# EAGLE design RobotController (EAGLE 9.3.1)
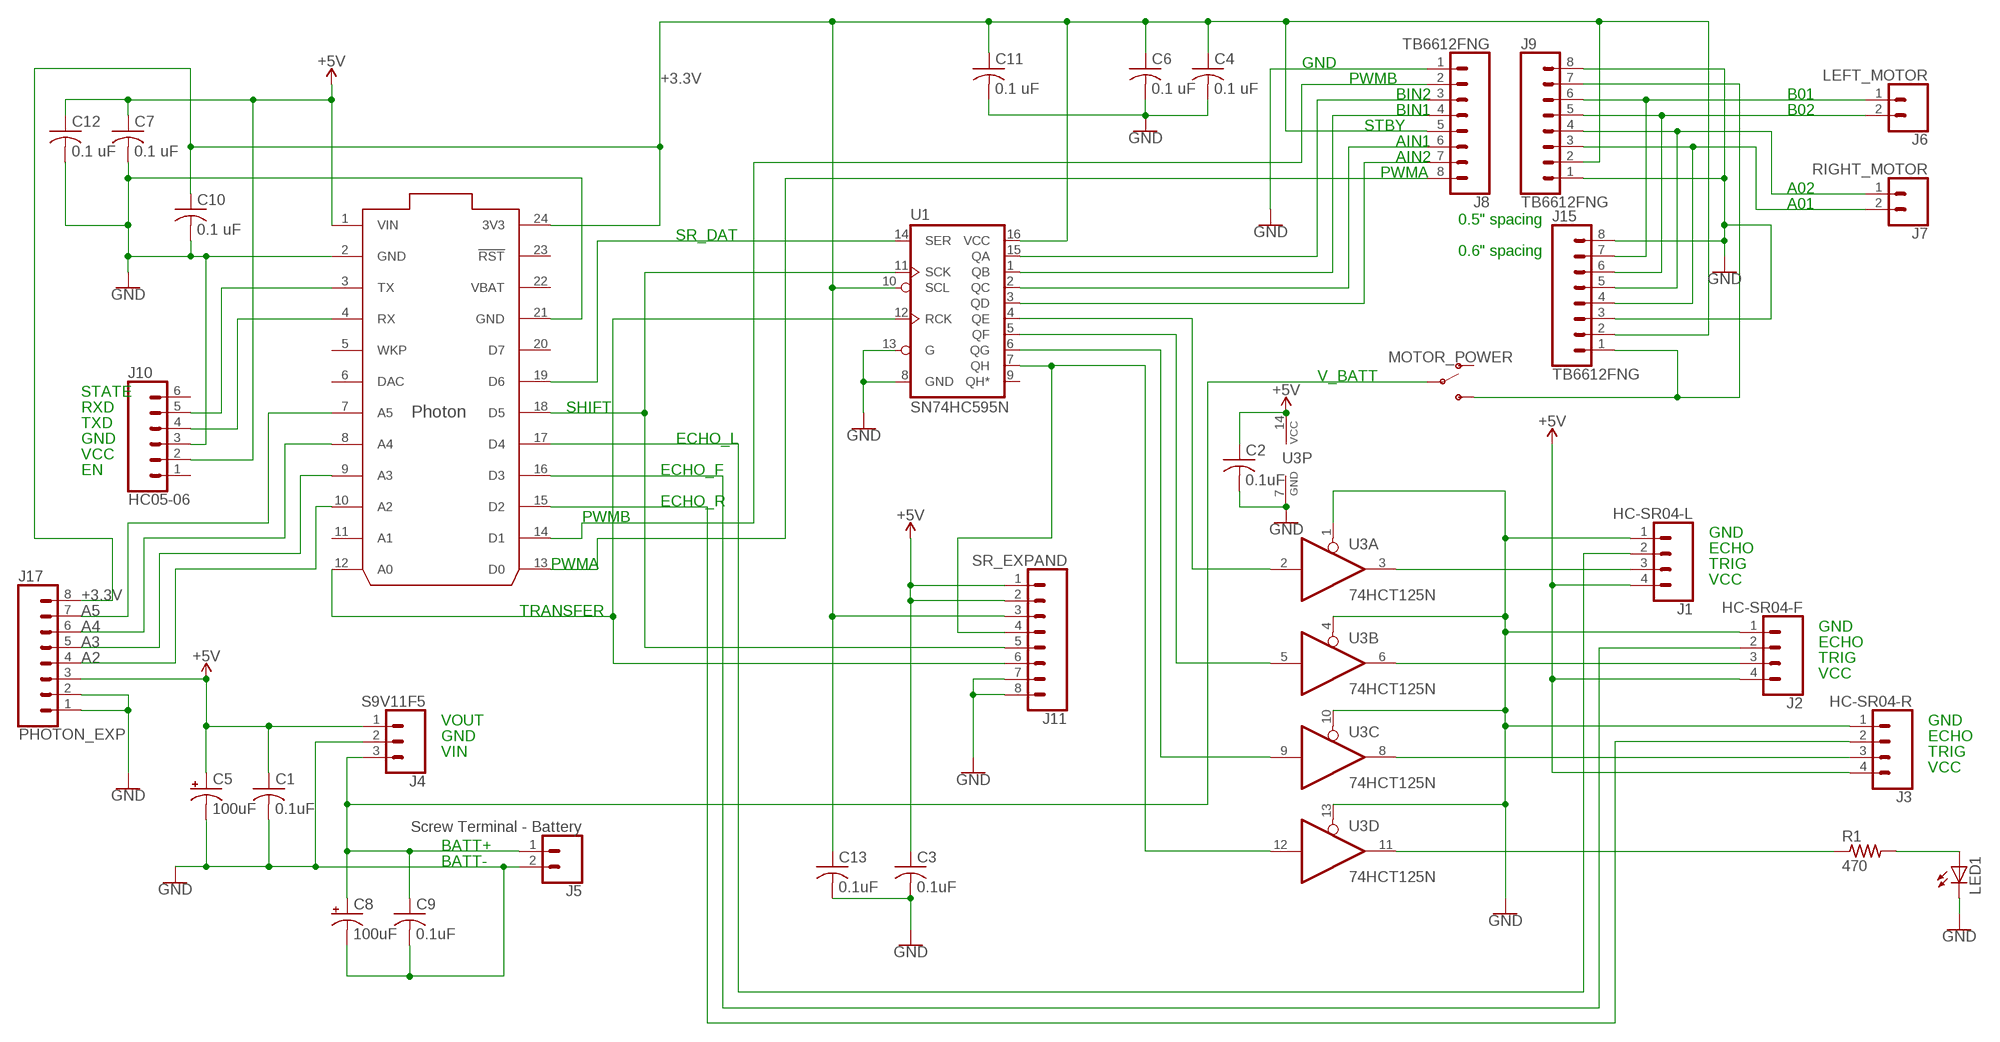
[diagram p0: schematic, sheet 1]

## Parts
C1  0.1uF  C-US025-024X044  [C025-024X044]
C2  0.1uF  C-US025-024X044  [C025-024X044]
C3  0.1uF  C-US025-024X044  [C025-024X044]
C4  0.1 uF  C-US025-024X044  [C025-024X044]
C5  100uF  CPOL-USE2,5-6E  [E2,5-6E]
C6  0.1 uF  C-US025-024X044  [C025-024X044]
C7  0.1 uF  C-US025-024X044  [C025-024X044]
C8  100uF  CPOL-USE2,5-6E  [E2,5-6E]
C9  0.1uF  C-US025-024X044  [C025-024X044]
C10  0.1 uF  C-US025-024X044  [C025-024X044]
C11  0.1 uF  C-US025-024X044  [C025-024X044]
C12  0.1 uF  C-US025-024X044  [C025-024X044]
C13  0.1uF  C-US025-024X044  [C025-024X044]
J1  HC-SR04-L  CONN_04  [1X04]
J2  HC-SR04-F  CONN_04  [1X04]
J3  HC-SR04-R  CONN_04  [1X04]
J4  S9V11F5  CONN_03  [1X03]
J5  Screw Terminal - Battery  CONN_023.5MM  [SCREWTERMINAL-3.5MM-2]
J6  LEFT_MOTOR  CONN_023.5MM  [SCREWTERMINAL-3.5MM-2]
J7  RIGHT_MOTOR  CONN_023.5MM  [SCREWTERMINAL-3.5MM-2]
J8  TB6612FNG  CONN_08"  [1X08]
J9  TB6612FNG  CONN_08"  [1X08]
J10  HC05-06  CONN_06SILK_FEMALE_PTH  [1X06]
J11  SR_EXPAND  CONN_08"  [1X08]
J15  TB6612FNG  CONN_08"  [1X08]
J17  PHOTON_EXP  CONN_08"  [1X08]
LED1  LED5MM  [LED5MM]
MOTOR_POWER  SWITCH-SPDT-PTH-11.6X4.0MM  [SWITCH_SPDT_PTH_11.6X4.0MM]
R1  470  R-US_0207/10  [0207/10]
U1  SN74HC595N  74HC595N  [DIP16]
U3  74HCT125N  [DIL14]
U$1  PHOTON_WITH_HEADERS  [PHOTON]

## Nets
+3.3V: C4.1 C6.1 C10.1 C11.1 C13.1 J8.5 J9.2 J11.3 J15.2 J17.8 U1.10(SCL) U1.16(VCC) U$1.24(3V3)
A2: J17.4 U$1.10(A2)
A3: J17.5 U$1.9(A3)
A4: J17.6 U$1.8(A4)
A5: J17.7 U$1.7(A5)
GND: C1.2 C2.2 C3.2 C4.2 C5.- C6.2 C7.2 C8.- C9.2 C10.2 C11.2 C12.2 C13.2 J1.1 J2.1 J3.1 J4.2 J5.2 J8.1 J9.1 J9.8 J10.3 J11.7 J11.8 J15.3 J15.8 J17.1 J17.2 LED1.K(C) U1.8(GND) U1.13(G) U3.1(A:OE) U3.4(B:OE) U3.7(P:GND) U3.10(C:OE) U3.13(D:OE) U$1.2(GND) U$1.21(GND)
N$1: U1.14(SER) U$1.19(D6)
N$3: J11.6 U1.12(RCK) U$1.12(A0)
N$4: J11.4 U1.7(QH) U3.12(D:I)
N$5: U1.4(QE) U3.2(A:I)
N$6: U1.5(QF) U3.5(B:I)
N$7: U1.6(QG) U3.9(C:I)
N$8: J9.7 J15.1 MOTOR_POWER.3(S)
N$10: J11.5 U1.11(SCK) U$1.18(D5)
N$13: C8.+ C9.1 J4.3 J5.1 MOTOR_POWER.2(P)
N$14: J1.3 U3.3(A:O)
N$15: J2.3 U3.6(B:O)
N$16: J3.3 U3.8(C:O)
N$17: R1.1 U3.11(D:O)
N$18: LED1.A R1.2
N$19: J7.2 J9.3 J15.4
N$20: J7.1 J9.4 J15.5
N$21: J6.2 J9.5 J15.6
N$22: J6.1 J9.6 J15.7
N$23: J2.2 U$1.16(D3)
N$24: J8.3 U1.15(QA)
N$25: J3.2 U$1.15(D2)
N$26: J8.4 U1.1(QB)
N$27: J8.6 U1.2(QC)
N$28: J8.7 U1.3(QD)
N$29: J1.2 U$1.17(D4)
N$30: J8.2 U$1.14(D1)
N$31: J8.8 U$1.13(D0)
N$32: J10.5 U$1.3(TX)
N$33: J10.4 U$1.4(RX)
VCC: C1.1 C2.1 C3.1 C5.+ C7.1 C12.1 J1.4 J2.4 J3.4 J4.1 J10.2 J11.1 J11.2 J17.3 U3.14(P:VCC) U$1.1(VIN) ; supply symbol labelled +5V
Unconnected: J10.1 J10.6 MOTOR_POWER.1(O) U1.9(QH*) U$1.5(WKP) U$1.6(DAC) U$1.11(A1) U$1.20(D7) U$1.23(!RST)

## Notes on the sheet
- GND
- PWMB
- BIN2 | B01
- BIN1 | B02
- STBY
- AIN1
- AIN2
- PWMA
- A02
- A01
- 0.5" spacing
- SR_DAT
- 0.6" spacing
- V_BATT
- STATE
- RXD | SHIFT
- TXD
- GND | ECHO_L
- VCC
- EN | ECHO_F
- ECHO_R
- PWMB
- GND
- ECHO
- PWMA | TRIG
- VCC
- TRANSFER
- GND
- ECHO
- TRIG
- VCC
- VOUT | GND
- GND | ECHO
- VIN | TRIG
- VCC
- BATT+
- BATT-

## Power pins joined to a net without a drawn wire
VBAT: U$1.22(VBAT)

## Library data of the parts
C1-C4 C6 C7 C9-C13 = rcl:C-US: CAPACITOR, American symbol; SPICEPREFIX: C
C5 C8 = rcl:CPOL-US: POLARIZED CAPACITOR, American symbol; SPICEPREFIX: C
J1-J3 = SparkFun-Connectors:CONN_04: Multi connection point. Often used as Generic Header-pin footprint for 0.1 inch spaced/style header connections On any of the 0.1 inch spaced packages, you can populate with these: Break Away Headers - Straight <https://www.sparkfun.com/products/116> (PRT-00116) Break Away Male Headers - Right Angle <https://www.sparkfun.com/products/553> (PRT-00553) Female Headers <https://www.sparkfun.com/products/115> (PRT-00115) Break Away Headers - Machine Pin <https://www.sparkfun.com/products/117> (PRT-00117) Break Away Female Headers - Swiss Machine Pin <https://www.sparkfun.com/products/743> (PRT-00743) For SCREWTERMINALS and SPRING TERMINALS visit here: Screw Terimnals on SparkFun.com <https://www.sparkfun.com/search/results?term=Screw+Terminals> (5mm/3.5mm/2.54mm spacing) This device is also useful as a general connection point to wire up your design to another part of your project. Our various solder wires solder well into these plated through hole pads. Hook-Up Wire - Assortment (Stranded, 22 AWG) <https://www.sparkfun.com/products/11375> (PRT-11375) Hook-Up Wire - Assortment (Solid Core, 22 AWG) <https://www.sparkfun.com/products/11367> (PRT-11367) View the entire wire category on our website here <https://www.sparkfun.com/categories/141> Special notes: Molex polarized connector foot print use with SKU : PRT-08231 with associated crimp pins and housings. 1MM SMD Version SKU: PRT-10208; PROD_ID: CONN-09696
J4 = SparkFun-Connectors:CONN_03: Multi connection point. Often used as Generic Header-pin footprint for 0.1 inch spaced/style header connections On any of the 0.1 inch spaced packages, you can populate with these: Break Away Headers - Straight <https://www.sparkfun.com/products/116> (PRT-00116) Break Away Male Headers - Right Angle <https://www.sparkfun.com/products/553> (PRT-00553) Female Headers <https://www.sparkfun.com/products/115> (PRT-00115) Break Away Headers - Machine Pin <https://www.sparkfun.com/products/117> (PRT-00117) Break Away Female Headers - Swiss Machine Pin <https://www.sparkfun.com/products/743> (PRT-00743) Stackable Header - 3 Pin (Female, 0.1") <https://www.sparkfun.com/products/13875> (PRT-13875) For SCREWTERMINALS and SPRING TERMINALS visit here: Screw Terimnals on SparkFun.com <https://www.sparkfun.com/search/results?term=Screw+Terminals> (5mm/3.5mm/2.54mm spacing) This device is also useful as a general connection point to wire up your design to another part of your project. Our various solder wires solder well into these plated through hole pads. Hook-Up Wire - Assortment (Stranded, 22 AWG) <https://www.sparkfun.com/products/11375> (PRT-11375) Hook-Up Wire - Assortment (Solid Core, 22 AWG) <https://www.sparkfun.com/products/11367> (PRT-11367) View the entire wire category on our website here <https://www.sparkfun.com/categories/141> Special notes: Molex polarized connector foot print use with SKU : PRT-08232 with associated crimp pins and housings.
J5-J7 = SparkFun-Connectors:CONN_02: Multi connection point. Often used as Generic Header-pin footprint for 0.1 inch spaced/style header connections On any of the 0.1 inch spaced packages, you can populate with these: Break Away Headers - Straight <https://www.sparkfun.com/products/116> (PRT-00116) Break Away Male Headers - Right Angle <https://www.sparkfun.com/products/553> (PRT-00553) Female Headers <https://www.sparkfun.com/products/115> (PRT-00115) Break Away Headers - Machine Pin <https://www.sparkfun.com/products/117> (PRT-00117) Break Away Female Headers - Swiss Machine Pin <https://www.sparkfun.com/products/743> (PRT-00743) For SCREWTERMINALS and SPRING TERMINALS visit here: Screw Terimnals on SparkFun.com <https://www.sparkfun.com/search/results?term=Screw+Terminals> (5mm/3.5mm/2.54mm spacing) This device is also useful as a general connection point to wire up your design to another part of your project. Our various solder wires solder well into these plated through hole pads. Hook-Up Wire - Assortment (Stranded, 22 AWG) <https://www.sparkfun.com/products/11375> (PRT-11375) Hook-Up Wire - Assortment (Solid Core, 22 AWG) <https://www.sparkfun.com/products/11367> (PRT-11367) View the entire wire category on our website here <https://www.sparkfun.com/categories/141> Special notes: Molex polarized connector foot print use with: PRT-08233 with associated crimp pins and housings. 2.54_SCREWTERM for use with PRT-10571. 3.5mm Screw Terminal footprints for PRT-08084 5mm Screw Terminal footprints for use with PRT-08432; PROD_ID: CONN-08399
J8 J9 J11 J15 J17 = SparkFun-Connectors:CONN_08: Multi connection point. Often used as Generic Header-pin footprint for 0.1 inch spaced/style header connections On any of the 0.1 inch spaced packages, you can populate with these: Break Away Headers - Straight <https://www.sparkfun.com/products/116> (PRT-00116) Break Away Male Headers - Right Angle <https://www.sparkfun.com/products/553> (PRT-00553) Female Headers <https://www.sparkfun.com/products/115> (PRT-00115) Break Away Headers - Machine Pin <https://www.sparkfun.com/products/117> (PRT-00117) Break Away Female Headers - Swiss Machine Pin <https://www.sparkfun.com/products/743> (PRT-00743) Arduino Stackable Header - 8 Pin <https://www.sparkfun.com/products/9279> (PRT-09279) For SCREWTERMINALS and SPRING TERMINALS visit here: Screw Terimnals on SparkFun.com <https://www.sparkfun.com/search/results?term=Screw+Terminals> (5mm/3.5mm/2.54mm spacing) This device is also useful as a general connection point to wire up your design to another part of your project. Our various solder wires solder well into these plated through hole pads. Hook-Up Wire - Assortment (Stranded, 22 AWG) <https://www.sparkfun.com/products/11375> (PRT-11375) Hook-Up Wire - Assortment (Solid Core, 22 AWG) <https://www.sparkfun.com/products/11367> (PRT-11367) View the entire wire category on our website here <https://www.sparkfun.com/categories/141> Special notes: Molex polarized connector foot print use with SKU : PRT-08231 with associated crimp pins and housings. 1MM SMD Version SKU: PRT-10208 NOTES ON THE VARIANTS LOCK and LOCK_LONGPADS... This footprint was designed to help hold the alignment of a through-hole component (i.e. 6-pin header) while soldering it into place. You may notice that each hole has been shifted either up or down by 0.005 of an inch from it's more standard position (which is a perfectly straight line). This slight alteration caused the pins (the squares in the middle) to touch the edges of the holes. Because they are alternating, it causes a "brace" to hold the component in place. 0.005 has proven to be the perfect amount of "off-center" position when using our standard breakaway headers. Although looks a little odd when you look at the bare footprint, once you have a header in there, the alteration is very hard to notice. Also,if you push a header all the way into place, it is covered up entirely on the bottom side.; PROD_ID: CONN-08438
J10 = SparkFun-Connectors:CONN_06: Multi connection point. Often used as Generic Header-pin footprint for 0.1 inch spaced/style header connections On any of the 0.1 inch spaced packages, you can populate with these: Break Away Headers - Straight <https://www.sparkfun.com/products/116> (PRT-00116) Break Away Male Headers - Right Angle <https://www.sparkfun.com/products/553> (PRT-00553) Female Headers <https://www.sparkfun.com/products/115> (PRT-00115) Break Away Headers - Machine Pin <https://www.sparkfun.com/products/117> (PRT-00117) Break Away Female Headers - Swiss Machine Pin <https://www.sparkfun.com/products/743> (PRT-00743) Arduino Stackable Header - 6 Pin <https://www.sparkfun.com/products/9280> (PRT-09280) For SCREWTERMINALS and SPRING TERMINALS visit here: Screw Terimnals on SparkFun.com <https://www.sparkfun.com/search/results?term=Screw+Terminals> (5mm/3.5mm/2.54mm spacing) This device is also useful as a general connection point to wire up your design to another part of your project. Our various solder wires solder well into these plated through hole pads. Hook-Up Wire - Assortment (Stranded, 22 AWG) <https://www.sparkfun.com/products/11375> (PRT-11375) Hook-Up Wire - Assortment (Solid Core, 22 AWG) <https://www.sparkfun.com/products/11367> (PRT-11367) View the entire wire category on our website here <https://www.sparkfun.com/categories/141>; PROD_ID: CONN-08437
LED1 = adafruit:LED: LED OSRAM: - CHIPLED LG R971, LG N971, LY N971, LG Q971, LY Q971, LO R971, LY R971 LH N974, LH R974 LS Q976, LO Q976, LY Q976 LO Q996 - Hyper CHIPLED LW Q18S LB Q993, LB Q99A, LB R99A - SideLED LS A670, LO A670, LY A670, LG A670, LP A670 LB A673, LV A673, LT A673, LW A673 LH A674 LY A675 LS A676, LA A676, LO A676, LY A676, LW A676 LS A679, LY A679, LG A679 - Hyper Micro SIDELED® LS Y876, LA Y876, LO Y876, LY Y876 LT Y87S - SmartLED LW L88C, LW L88S LB L89C, LB L89S, LG L890 LS L89K, LO L89K, LY L89K LS L896, LA L896, LO L896, LY L896 - TOPLED LS T670, LO T670, LY T670, LG T670, LP T670 LSG T670, LSP T670, LSY T670, LOP T670, LYG T670 LG T671, LOG T671, LSG T671 LB T673, LV T673, LT T673, LW T673 LH T674 LS T676, LA T676, LO T676, LY T676, LB T676, LH T676, LSB T676, LW T676 LB T67C, LV T67C, LT T67C, LS T67K, LO T67K, LY T67K, LW E67C LS E67B, LA E67B, LO E67B, LY E67B, LB E67C, LV E67C, LT E67C LW T67C LS T679, LY T679, LG T679 LS T770, LO T770, LY T770, LG T770, LP T770 LB T773, LV T773, LT T773, LW T773 LH T774 LS E675, LA E675, LY E675, LS T675 LS T776, LA T776, LO T776, LY T776, LB T776 LHGB T686 LT T68C, LB T68C - Hyper Mini TOPLED® LB M676 - Mini TOPLED Santana® LG M470 LS M47K, LO M47K, LY M47K Source: http://www.osram.convergy.de/
MOTOR_POWER = SparkFun-Switches:SWITCH-SPDT: Single Pole, Double Throw (SPDT) Switch Single-pole, double-throw (SPDT) switch. Variant Overview SMD-AYZ0202 Surface Mount DPDT Switch <https://www.sparkfun.com/products/597> (COM-00597) Used on e.g. LilyPad Arduino USB - ATmega32U4 Board <https://www.sparkfun.com/products/12049> PTH-11.6X4.0MM SPDT Mini Power Switch <https://www.sparkfun.com/products/102> (COM-00102) Used on e.g. SparkFun Simon Says - Through-Hole Soldering Kit <https://www.sparkfun.com/products/10547> (KIT-10547) PTH-11.6X4.0MM-KIT KIT version of SPDT Mini Power Switch - Simplifies soldering by removing tStop of switch pins - only one side can be soldered. PTH-11.6X4.0MM-LOCK LOCK version of SPDT Mini Power Switch - Offset pins hold switch in place for easier soldering. SMD-RIGHT-ANGLE Surface Mount Right Angle Switch <https://www.sparkfun.com/products/10860> (COM-10860) Used on e.g. SparkFun ESP8266 Thing <https://www.sparkfun.com/products/13231>; PROD_ID: SWCH-08261; SF_SKU: COM-00102
R1 = rcl:R-US_: RESISTOR, American symbol; SPICEPREFIX: R
U1 = SparkFun-IC-Logic:74*595: 8-Bit Shift Register (Serial to Parallel) Datasheet <http://cdn.sparkfun.com/datasheets/BreakoutBoards/MM74HC595.pdf> SparkFun Products SparkFun Shift Register Breakout - 74HC595 <https://www.sparkfun.com/products/10680> (BOB-10680); PROD_ID: IC-13123
U3 = 74xx-eu:74*125: Quad bus BUFFER, 3-state
U$1 = Particle-Devices:PHOTON: Particle Photon Wi-Fi through-hole development board footprint Product datasheet: here <https://docs.particle.io/datasheets/photon-(wifi)/photon-datasheet/> Design files: here <https://github.com/particle-iot/photon> Github : Particle devices library <https://github.com/particle-iot/hardware-libraries/tree/master/Eagle>

## Board
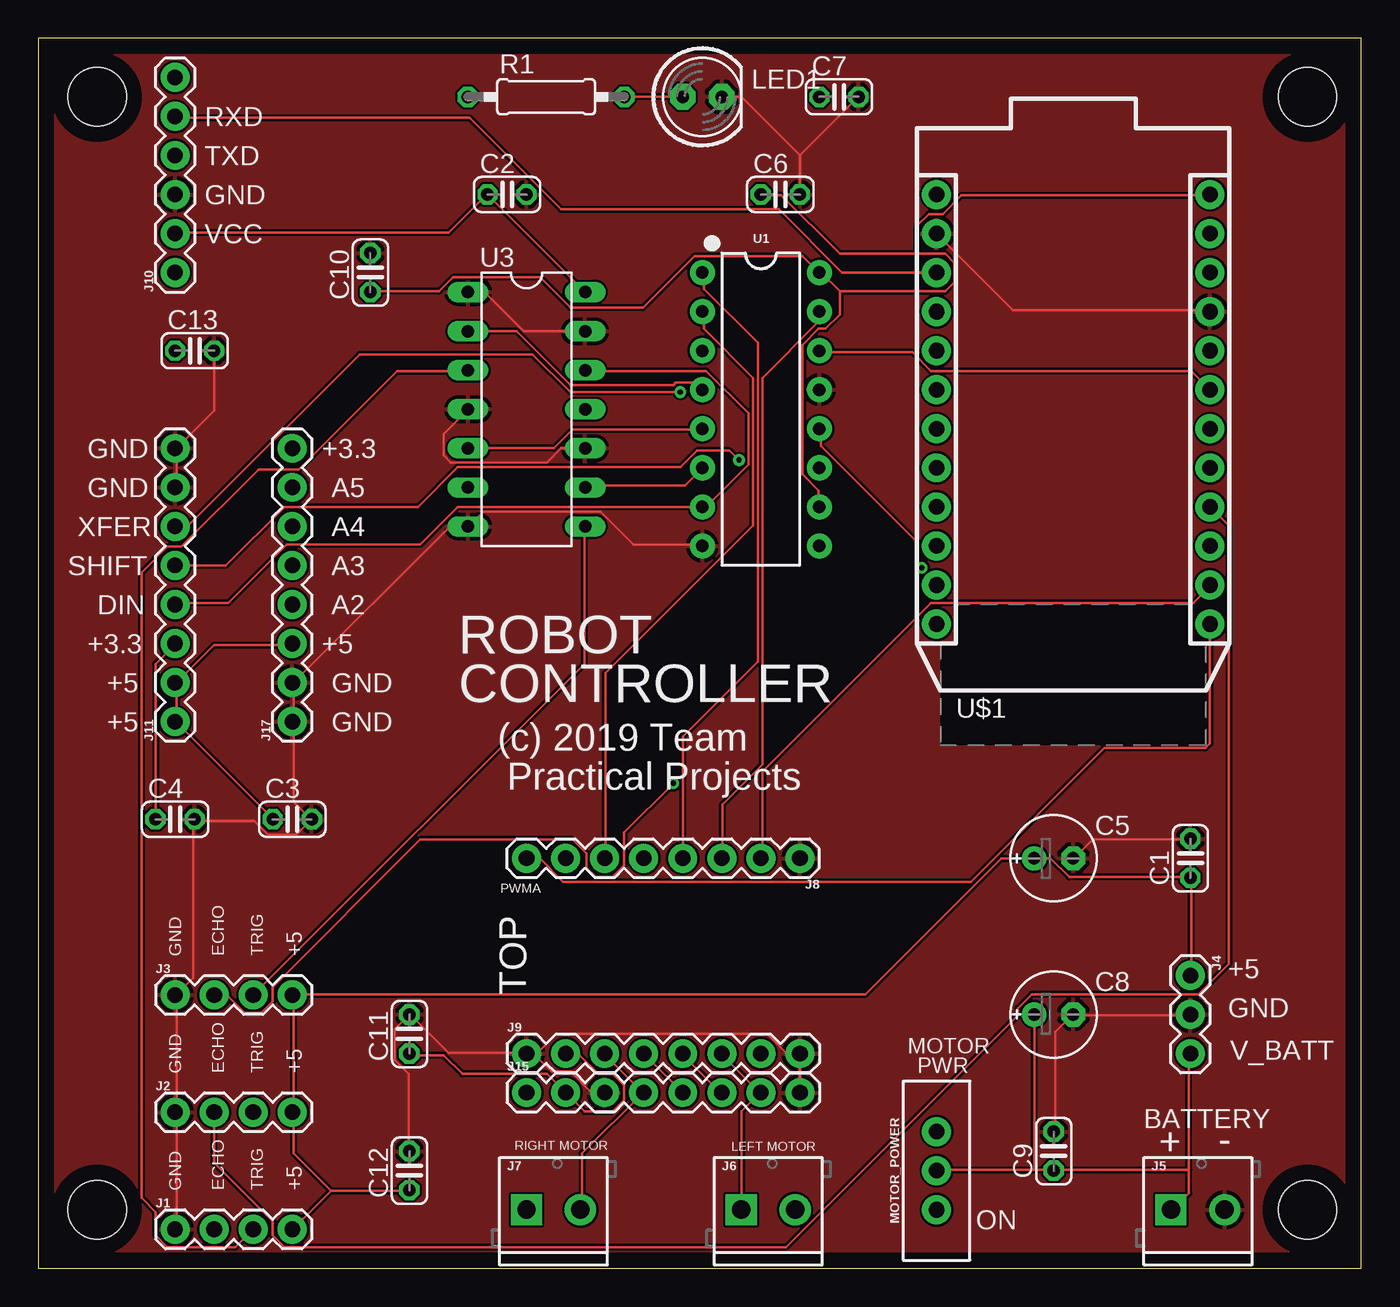
[diagram p1: board, top side]
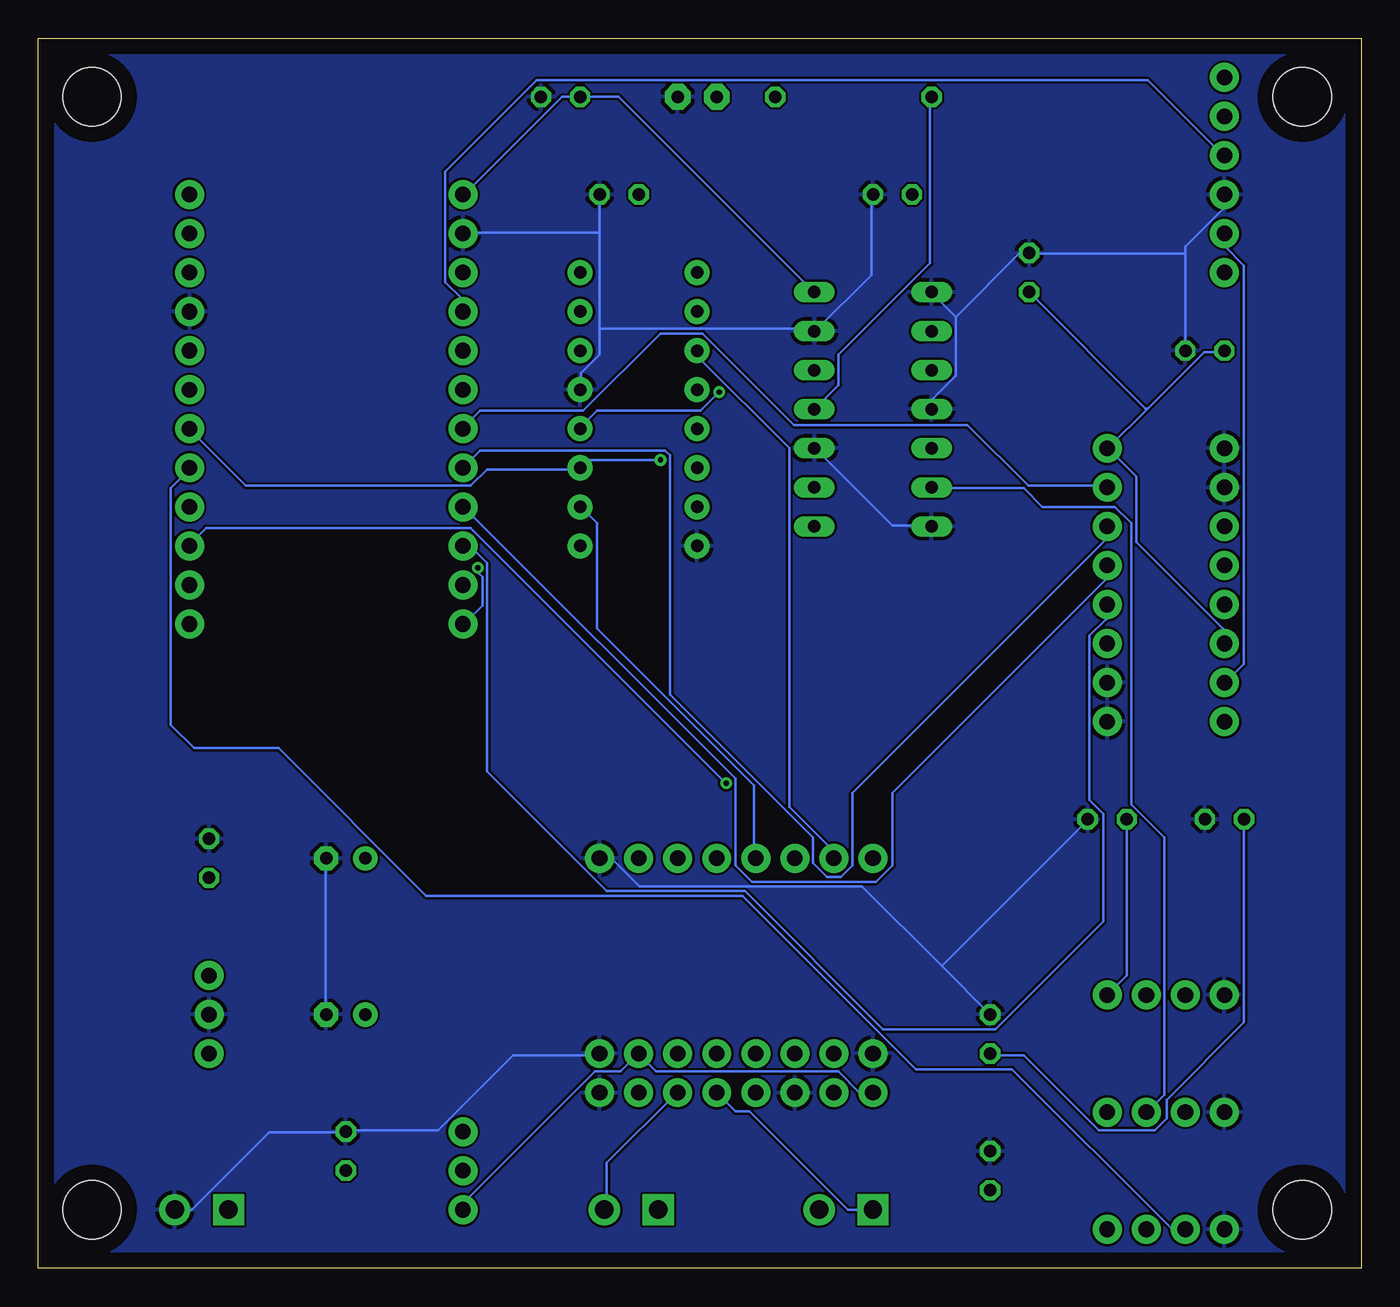
[diagram p2: board, bottom side, seen from below]

Size 86.03 x 80 mm. Coordinates in mm from the lower left corner, seen from the top.
Outline: 0,0 86.03,0 86.03,80 0,80 0,0
Copper layers (1*16): Top 0.035mm / dielectric 1.5mm / Bottom 0.035mm
Design rules "default": minimum track width 6mil, minimum drill 0.35mm, track to track 6mil, track to pad 6mil, pad to pad 6mil, via to via 6mil, smd to smd 6mil, copper to edge 40mil, drill to drill 6mil, minimum pad ring 10mil, minimum via ring 8mil, stop-mask expansion 4mil, vias tented up to drill 0mil, thermal gap 10mil
Holes 3.8 mm at 3.81,76.2 82.55,76.2 82.55,3.81 3.81,3.81

### Footprints (pad centres in the part's own frame; a part is rotated, then mirrored left to right if it is on the bottom)
C025-024X044 = drill 0.813 octagon: 1 -1.27,0; 2 1.27,0
E2,5-6E = drill 0.813 pad 1.575: + -1.27,0 | drill 0.813 pad 1.575 octagon: - 1.27,0
1X04 = drill 1.016 pad 1.88: 1 0,0; 2 2.54,0; 3 5.08,0; 4 7.62,0
1X03 = drill 1.016 pad 1.88: 1 0,0; 2 2.54,0; 3 5.08,0
SCREWTERMINAL-3.5MM-2 = drill 1.2 pad 2.032 square: 1 0,0 | drill 1.2 pad 2.032: 2 3.5,0
1X08 = drill 1.016 pad 1.88: 1 0,0; 2 2.54,0; 3 5.08,0; 4 7.62,0; 5 10.16,0; 6 12.7,0; 7 15.24,0; 8 17.78,0
1X06 = drill 1.016 pad 1.88: 1 0,0; 2 2.54,0; 3 5.08,0; 4 7.62,0; 5 10.16,0; 6 12.7,0
LED5MM = drill 0.813 pad 1.676 octagon: A -1.27,0; K 1.27,0
SWITCH_SPDT_PTH_11.6X4.0MM = drill 1.016 pad 1.88: 1 0,2.54; 2 0,0; 3 0,-2.54
0207/10 = drill 0.813 octagon: 1 -5.08,0; 2 5.08,0
DIP16 = drill 0.813 pad 1.626: 1 -8.89,-3.81; 2 -6.35,-3.81; 3 -3.81,-3.81; 4 -1.27,-3.81; 5 1.27,-3.81; 6 3.81,-3.81; 7 6.35,-3.81; 8 8.89,-3.81; 9 8.89,3.81; 10 6.35,3.81; 11 3.81,3.81; 12 1.27,3.81; 13 -1.27,3.81; 14 -3.81,3.81; 15 -6.35,3.81; 16 -8.89,3.81
DIL14 = drill 0.813 long: 1 -7.62,-3.81; 2 -5.08,-3.81; 3 -2.54,-3.81; 4 0,-3.81; 5 2.54,-3.81; 6 5.08,-3.81; 7 7.62,-3.81; 8 7.62,3.81; 9 5.08,3.81; 10 2.54,3.81; 11 0,3.81; 12 -2.54,3.81; 13 -5.08,3.81; 14 -7.62,3.81
PHOTON = drill 1.016 pad 1.88: 1 1.27,33.02; 2 1.27,30.48; 3 1.27,27.94; 4 1.27,25.4; 5 1.27,22.86; 6 1.27,20.32; 7 1.27,17.78; 8 1.27,15.24; 9 1.27,12.7; 10 1.27,10.16; 11 1.27,7.62; 12 1.27,5.08; 13 19.05,5.08; 14 19.05,7.62; 15 19.05,10.16; 16 19.05,12.7; 17 19.05,15.24; 18 19.05,17.78; 19 19.05,20.32; 20 19.05,22.86; 21 19.05,25.4; 22 19.05,27.94; 23 19.05,30.48; 24 19.05,33.02

### Placement (x,y rotation side)
C1  74.93,26.67 90 top
C2  30.48,69.85 0 top
C3  16.51,29.21 0 top
C4  8.89,29.21 0 top
C5  66.04,26.67 0 top
C6  48.26,69.85 0 top
C7  52.07,76.2 0 top
C8  66.04,16.51 0 top
C9  66.04,7.62 90 top
C10  21.59,64.77 90 top
C11  24.13,15.24 90 top
C12  24.13,6.35 90 top
C13  10.16,59.69 0 top
J1  8.89,2.54 0 top
J2  8.89,10.16 0 top
J3  8.89,17.78 0 top
J4  74.93,19.05 270 top
J5  73.66,3.81 0 top
J6  45.72,3.81 0 top
J7  31.75,3.81 0 top
J8  49.53,26.67 180 top
J9  31.75,13.97 0 top
J10  8.89,64.77 90 top
J11  8.89,35.56 90 top
J15  31.75,11.43 0 top
J17  16.51,35.56 90 top
LED1  43.18,76.2 0 top
MOTOR_POWER  58.42,6.35 0 top
R1  33.02,76.2 0 top
U1  46.99,55.88 270 top
U3  31.75,55.88 270 top
U$1  57.15,36.83 0 top

### Tracks (layer width: path | path; a pad name or v marks a point on that pad's centre or on a via)
+3.3V
  Top 0.152: C11.1 24.23,13.87 26.36,13.87 27.58,12.65 33.07,12.65 J15.2 35.51,10.21 37.34,10.21 38.1,10.97 38.1,11.89 37.34,12.65 36.42,12.65 35.2,13.87 34.29,13.87 J9.2 | C4.1 7.62,39.32 8.84,40.54 J11.3 | 57.15,65.99 58.98,65.99 59.59,65.38 59.59,64.16 58.98,63.55 52.12,63.55 | 57.15,65.99 52.12,65.99 48.31,69.8 47.09,69.8 C6.1 | 52.12,63.55 50.9,64.77 U1.16 50.75,64.77 49.68,65.84 42.67,65.84 39.32,62.48 34.59,62.48 32.61,64.47 26.98,64.47 26.06,63.55 21.64,63.55 C10.1 | 52.12,63.55 52.12,62.03 51.21,61.11 50.75,61.11 49.68,60.05 49.68,51.66 50.75,50.6 50.75,49.53 U1.10 | 57.15,65.99 57.15,67.82 57.91,68.58 58.83,68.58 60.05,69.8 76.2,69.8 U$1.24
  Bottom 0.152: 16.46,53.34 13.87,55.93 | 13.87,55.93 10.21,59.59 8.99,59.59 C13.1 | C10.1 14.02,55.93 13.87,55.93 | 16.46,53.34 14.63,51.51 14.63,47.24 8.99,41.6 8.99,40.69 J11.3 | 16.46,53.34 J17.8 | C4.1 7.62,16 12.65,10.97 12.65,9.75 13.41,8.99 17.07,8.99 21.95,13.87 24.08,13.87 C11.1 | J8.5 39.47,26.67 39.47,31.39 49.68,41.6 49.68,48.46 50.75,49.53 U1.10
A2
  Bottom 0.152: J17.4 16.61,43.13 16.61,42.22 17.68,41.15 17.68,30.48 16.76,29.57 16.76,22.55 23.77,15.54 31.09,15.54 40.08,24.54 49.07,24.54 56.84,32.31 56.84,45.87 57.91,46.94 58.37,46.94 U$1.10
A3
  Bottom 0.152: J17.5 16.61,45.72 16.61,44.81 30.48,30.94 30.48,26.21 31.55,25.15 39.62,25.15 40.69,26.21 40.69,31.85 58.37,49.53 U$1.9
A4
  Bottom 0.152: U$1.8 57.3,53.19 45.26,53.19 44.96,52.88 44.96,37.34 35.66,28.04 35.66,26.36 34.75,25.45 33.83,25.45 33.07,26.21 33.07,30.94 16.61,47.4 16.61,48.16 J17.6
A5
  Bottom 0.152: J17.7 16.61,50.9 21.64,50.9 25.6,54.86 36.88,54.86 42.82,60.81 45.57,60.81 50.6,55.78 57.3,55.78 58.37,54.71 U$1.7
GND
  Top 0.152: 49.53,72.39 C6.2 | C7.2 49.53,72.39 | LED1.K 45.72,76.2 49.53,72.39 | U$1.2 63.4,62.33 76.2,62.33 U$1.21 | C13.2 11.43,55.78 8.99,53.34 | 8.99,53.34 8.99,50.9 J11.7 | 8.99,53.34 J11.8 | U1.8 43.13,47.09 38.71,47.09 36.58,49.23 28.96,49.23 28.04,48.31 U3.7 27.89,48.16 26.67,48.16 16.61,38.1 | U3.13 31.55,60.96 29.11,63.4 28.04,63.4 U3.1 | U3.10 33.98,53.34 33.07,52.43 26.82,52.43 26.36,52.88 26.36,54.25 27.89,55.78 U3.4 | 16.61,38.1 16.61,35.66 J17.1 16.61,35.51 16.61,30.33 17.68,29.26 C3.2 16.76,28.19 14.94,28.19 14.02,29.11 10.21,29.11 C4.2 10.06,29.11 10.06,18.9 8.99,17.83 J3.1 8.99,17.68 8.99,10.21 J2.1 8.99,10.06 8.99,2.59 J1.1 | C1.2 74.83,27.89 68.58,27.89 67.36,26.67 C5.- | C9.2 66.14,8.99 66.14,15.39 67.21,16.46 C8.- 67.36,16.46 74.83,16.46 J4.2 | J15.8 J9.8 49.53,14.02 48.62,14.02 47.4,15.24 33.68,15.24 32.31,13.87 | J15.3 35.97,11.43 34.59,12.8 33.38,12.8 32.31,13.87 | 32.31,13.87 31.85,13.87 J9.1 | 32.31,13.87 J9.1 | C12.2 24.08,7.62 24.08,12.65 23.16,13.56 23.16,15.54 C11.2 24.23,16.46 26.67,14.02 31.7,14.02 J9.1 | 16.61,38.1 J17.2
  Bottom 0.152: C6.2 49.53,67.36 | 49.53,67.36 49.53,61.11 | 49.53,61.11 49.53,59.44 50.75,58.22 50.75,57.15 U1.13 | 49.53,67.36 58.37,67.36 U$1.2 | C13.2 11.43,65.99 | 11.43,65.99 11.43,66.45 8.99,68.89 8.99,69.8 J10.3 | U3.7 28.04,48.31 30.48,48.31 35.51,53.34 U3.10 | 26.36,61.87 26.36,58.06 27.89,56.54 27.89,55.93 U3.4 | 26.36,61.87 27.89,63.4 U3.1 | 26.36,61.87 22.25,65.99 21.64,65.99 C10.2 21.49,65.99 11.43,65.99 | C2.2 31.85,69.8 31.85,64.62 35.51,60.96 U3.13 35.66,60.96 35.81,61.11 49.53,61.11 | J5.2 76.05,3.81 71.02,8.84 66.14,8.84 C9.2 65.99,8.99 60.05,8.99 55.17,13.87 49.53,13.87 J9.8 | C5.- 67.36,26.67 67.36,16.61 C8.- | J8.1 48.77,26.67 46.94,24.84 32.46,24.84 27.28,19.66 | C11.2 27.28,19.66 | 27.28,19.66 17.83,29.11 C3.2
  pour Top: 0,81.28 86.36,81.28 86.36,0 0,0
  pour Bottom: 0,81.28 86.36,81.28 86.36,0 0,0
N$1
  Top 0.152: U$1.19 74.98,58.37 58.06,58.37 56.84,59.59 50.9,59.59 U1.14
N$3  (via drill 0.35)
  Top 0.152: v57.45,45.57 57.15,45.87 57.15,47.24 50.9,53.49 50.9,54.56 U1.12 | v41.76,57 34.59,57 32.16,59.44 20.88,59.44 9.75,48.31 8.99,48.31 J11.6
  Bottom 0.152: v57.45,45.57 57.45,45.26 57.15,44.96 57.15,43.13 58.37,41.91 U$1.12 | v41.76,57 42.98,55.78 49.68,55.78 50.75,54.71 U1.12
N$4
  Top 0.152: U3.12 35.66,58.37 43.43,58.37 46.18,55.63 46.18,52.27 43.43,49.53 U1.7 27.28,49.53 24.84,47.09 16.15,47.09 12.34,43.28 8.99,43.28 J11.4
N$5
  Top 0.152: U3.2 31.09,60.96 34.59,57.45 41.3,57.45 41.45,57.61 42.67,57.61 43.13,57.15 U1.4
N$6
  Top 0.152: U3.5 33.53,53.34 34.75,54.56 43.13,54.56 U1.5
N$7
  Top 0.152: U3.9 35.66,50.9 42.06,50.9 43.13,51.97 U1.6
N$8
  Bottom 0.152: J15.1 32.61,11.43 33.98,12.8 45.87,12.8 46.94,13.87 J9.7 48.16,12.8 49.84,12.8 58.37,4.27 58.37,3.81 MOTOR_POWER.3
N$10  (via drill 0.35)
  Top 0.152: J11.5 12.19,45.72 16,49.53 24.69,49.53 27.28,52.12 41.76,52.12 42.82,53.19 44.96,53.19 v45.57,52.58
  Bottom 0.152: U$1.18 76.2,54.56 72.54,50.9 57.91,50.9 56.84,51.97 50.9,51.97 U1.11 50.29,52.58 v45.57,52.58
N$13
  Top 0.152: 74.83,6.4 74.83,4.88 73.76,3.81 J5.1 | 74.83,6.4 74.83,13.87 J4.3 | 64.77,6.4 58.52,6.4 MOTOR_POWER.2 | 64.77,6.4 65.99,6.4 C9.1 66.14,6.4 74.83,6.4 | 64.77,6.4 C8.+
N$14
  Top 0.152: J1.3 12.8,1.37 8.38,1.37 7.62,2.13 7.62,3.66 6.71,4.57 6.71,45.26 8.38,46.94 9.3,46.94 14.33,51.97 16.92,51.97 23.32,58.37 27.89,58.37 U3.3
N$15
  Bottom 0.152: U3.6 27.89,50.75 21.95,50.75 20.73,49.53 16,49.53 14.94,48.46 14.94,30.18 12.8,28.04 12.8,11.28 13.87,10.21 J2.3
N$16
  Top 0.152: J3.3 35.51,39.32 35.51,48.16 U3.8
N$17
  Bottom 0.152: U3.11 33.98,57.45 33.98,59.44 28.04,65.38 28.04,76.2 R1.1
N$18
  Top 0.152: LED1.A R1.2
N$19
  Top 0.152: 39.32,11.43 36.88,13.87 J9.3 | 39.32,11.43 35.36,7.47 35.36,3.81 J7.2 | 39.32,11.43 J15.4
N$20
  Top 0.152: J9.4 J15.5
  Bottom 0.152: J7.1 33.38,3.81 39.78,10.21 40.69,10.21 J15.5
N$21
  Top 0.152: J15.6 44.35,11.43 41.91,13.87 J9.5
  Bottom 0.152: J6.2 49.07,3.81 49.07,6.86 44.5,11.43 J15.6
N$22
  Top 0.152: 46.94,11.43 44.5,13.87 J9.6 | J6.1 45.72,10.21 46.94,11.43 | 46.94,11.43 J15.7
N$23
  Top 0.152: J2.2 11.43,6.86 15.24,3.05 15.24,2.13 16,1.37 48.62,1.37 63.7,16.46 63.7,16.92 64.62,17.83 75.44,17.83 77.42,19.81 77.42,48.31 U$1.16
N$24
  Top 0.152: U1.15 50.75,62.18 50.75,61.57 47.09,57.91 47.09,32.77 44.5,30.18 44.5,26.67 J8.3
N$25  (via drill 0.35)
  Top 0.152: v41.3,31.55 38.1,28.35 38.1,26.21 37.34,25.45 36.27,25.45 35.66,26.06 35.66,26.98 34.75,27.89 24.84,27.89 15.24,18.29 15.24,17.37 14.48,16.61 13.41,16.61 12.34,17.68 11.43,17.68 J3.2
  Bottom 0.152: v41.3,31.55 57.91,48.16 75.13,48.16 76.2,47.09 U$1.15
N$26
  Top 0.152: J8.4 41.91,34.59 46.79,39.47 46.79,60.2 43.28,63.7 43.28,64.77 U1.1
N$27
  Top 0.152: U1.2 43.28,62.18 43.28,61.11 46.48,57.91 46.48,48.31 36.88,38.71 36.88,26.67 J8.6
N$28
  Bottom 0.152: J8.7 34.29,27.13 37.19,30.02 37.19,53.34 43.13,59.28 43.13,59.59 U1.3
N$29
  Bottom 0.152: J1.2 11.43,2.59 12.34,2.59 22.71,12.95 28.96,12.95 40.23,24.23 60.81,24.23 70.41,33.83 75.89,33.83 77.42,35.36 77.42,50.75 76.2,51.97 U$1.17
N$30
  Top 0.152: J8.2 47.09,26.67 47.09,32.31 58.06,43.28 75.13,43.28 76.2,44.35 U$1.14
N$31
  Top 0.152: J8.8 32.61,26.67 34.14,25.15 60.66,25.15 69.34,33.83 75.89,33.83 76.2,34.14 U$1.13
N$32
  Top 0.152: U$1.3 52.27,64.77 48.16,68.89 33.98,68.89 28.04,74.83 8.99,74.83 J10.5
N$33
  Bottom 0.152: U$1.4 58.52,62.33 58.52,63.09 59.59,64.16 59.59,71.32 53.65,77.27 13.87,77.27 8.99,72.39 J10.4
VCC
  Top 0.152: U3.14 C2.1 29.11,69.8 26.67,67.36 8.99,67.36 J10.2 | C3.1 15.24,29.26 8.99,35.51 J11.1 8.99,35.66 8.99,38.1 | 8.99,38.1 11.43,40.54 16.46,40.54 J17.3 | 8.99,38.1 J11.2 | J4.1 74.98,19.05 74.98,25.3 C1.1 74.83,25.45 67.06,25.45 65.84,26.67 C5.+ 62.64,26.67 53.8,17.83 16.61,17.83 J3.4 16.61,17.68 16.61,10.21 J2.4 16.61,10.06 16.61,7.47 19.05,5.03 | 19.05,5.03 24.08,5.03 C12.1 | 19.05,5.03 16.61,2.59 J1.4
  Bottom 0.152: U$1.1 58.37,69.8 51.97,76.2 C7.1 48.31,76.2 35.66,63.55 U3.14 | C3.1 15.24,19.05 J3.4 | J10.2 8.84,67.21 8.84,66.45 7.62,65.23 7.62,39.32 8.84,38.1 J11.2

### Text on the board
tPlace: RXD | TXD | GND | VCC | GND | +3.3 | GND | A5 | XFER | A4 | SHIFT | A3 | DIN | A2 | +3.3 | +5 | ROBOT | +5 | GND | CONTROLLER | +5 | GND | (c) 2019 Team | Practical Projects | PWMA | GND | ECHO | TRIG | +5 | +5 | TOP | GND | MOTOR | V_BATT | GND | ECHO | TRIG | +5 | PWR | BATTERY | RIGHT MOTOR | LEFT MOTOR | + | - | GND | ECHO | TRIG | +5 | ON